# EAGLE design luxeon_r6_smd (EAGLE 5.08)
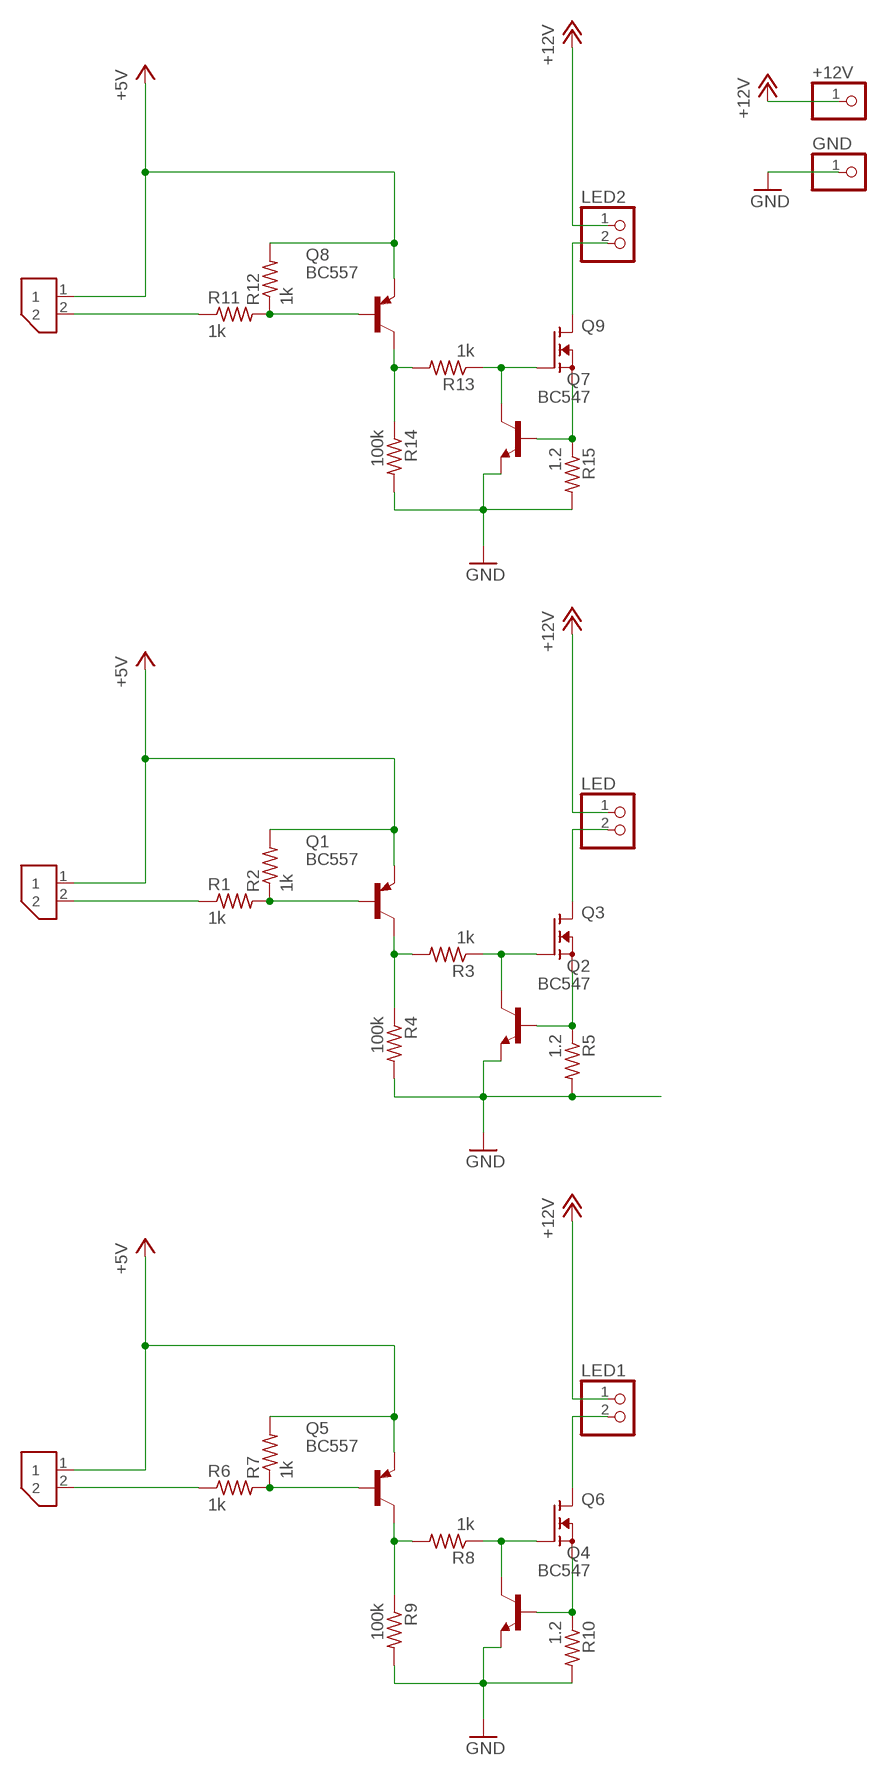
[diagram p0: schematic, sheet 1]

## Parts
+12V  PINHD-1X1  [1X01]
GND  PINHD-1X1  [1X01]
LED  PINHD-1X2  [1X02]
LED1  PINHD-1X2  [1X02]
LED2  PINHD-1X2  [1X02]
Q1  BC557  [TO92]
Q2  BC547  [TO92]
Q3  TOSHIBA-2SK4033  [TO252]
Q4  BC547  [TO92]
Q5  BC557  [TO92]
Q6  TOSHIBA-2SK4033  [TO252]
Q7  BC547  [TO92]
Q8  BC557  [TO92]
Q9  TOSHIBA-2SK4033  [TO252]
R1  1k  R-US_R0402  [R0402]
R2  1k  R-US_R0402  [R0402]
R3  1k  R-US_R0402  [R0402]
R4  100k  R-US_R0402  [R0402]
R5  1.2  R-US_R2512  [R2512]
R6  1k  R-US_R0402  [R0402]
R7  1k  R-US_R0402  [R0402]
R8  1k  R-US_R0402  [R0402]
R9  100k  R-US_R0402  [R0402]
R10  1.2  R-US_R2512  [R2512]
R11  1k  R-US_R0402  [R0402]
R12  1k  R-US_R0402  [R0402]
R13  1k  R-US_R0402  [R0402]
R14  100k  R-US_R0402  [R0402]
R15  1.2  R-US_R2512  [R2512]
TO_SLAVE  MOLEX-SPOX-HEADER-2-RA  [SPOX-WTB-HEADER-2-RA]
TO_SLAVE1  MOLEX-SPOX-HEADER-2-RA  [SPOX-WTB-HEADER-2-RA]
TO_SLAVE2  MOLEX-SPOX-HEADER-2-RA  [SPOX-WTB-HEADER-2-RA]

## Nets
+5V: Q1.1(E) Q5.1(E) Q8.1(E) R2.2 R7.2 R12.2 TO_SLAVE1.1 TO_SLAVE2.1 TO_SLAVE.1
+12V: +12V.1 LED1.1 LED2.1 LED.1
DISSIPATE: LED.2 Q3.3(D)
DISSIPATE1: LED1.2 Q6.3(D)
DISSIPATE2: LED2.2 Q9.3(D)
GND: GND.1 Q2.1(E) Q4.1(E) Q7.1(E) R4.2 R5.2 R9.2 R10.2 R14.2 R15.2
N$1: Q1.2(B) R1.2 R2.1
N$2: Q2.3(C) Q3.1(G) R3.1
N$3: Q1.3(C) R3.2 R4.1
N$4: Q2.2(B) Q3.2(S) R5.1
N$5: Q5.2(B) R6.2 R7.1
N$6: Q5.3(C) R8.2 R9.1
N$7: Q4.2(B) Q6.2(S) R10.1
N$8: Q4.3(C) Q6.1(G) R8.1
N$9: Q8.2(B) R11.2 R12.1
N$10: Q8.3(C) R13.2 R14.1
N$11: Q7.2(B) Q9.2(S) R15.1
N$12: Q7.3(C) Q9.1(G) R13.1
SLV: R1.1 TO_SLAVE.2
SLV1: R6.1 TO_SLAVE1.2
SLV2: R11.1 TO_SLAVE2.2

## Library data of the parts
+12V GND = pinhead:PINHD-1X1: PIN HEADER
LED LED1 LED2 = pinhead:PINHD-1X2: PIN HEADER
Q1 Q5 Q8 = transistor-pnp:BC557: PNP Transistor
Q2 Q4 Q7 = transistor:BC547: NPN TRANSISTOR
Q3 Q6 Q9 = damians_bits:TOSHIBA-2SK4033: TOSHIBA 2SK4033 Field Effect Transistor N-Channel MOSFET
R1-R15 = resistor:R-US_: RESISTOR, American symbol
TO_SLAVE TO_SLAVE1 TO_SLAVE2 = damians_bits:MOLEX-SPOX-HEADER-2-RA: Molex SPOX 22-05-7025 WTB Header, Right-angle, 2 way

## Board
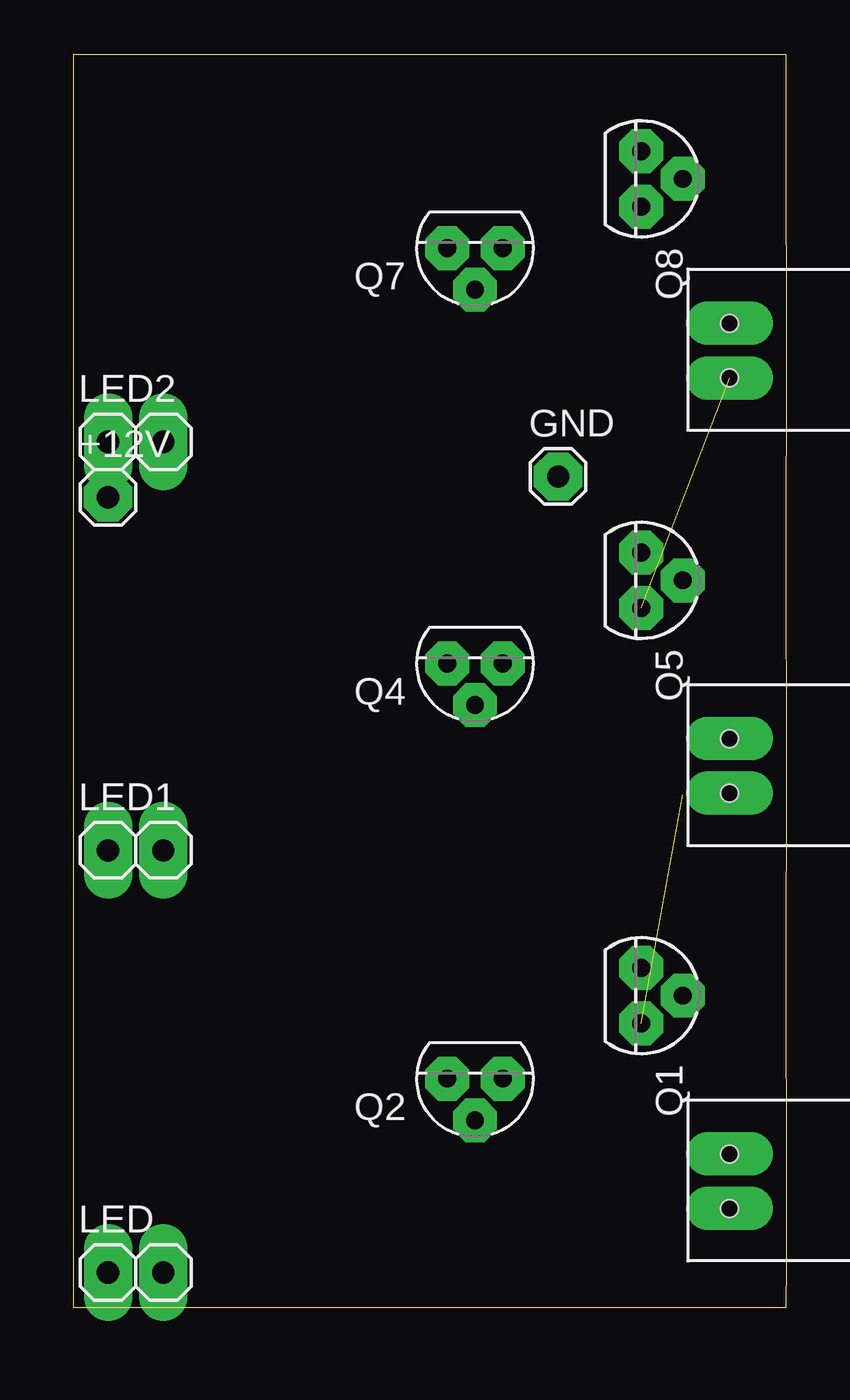
[diagram p1: board, top side]
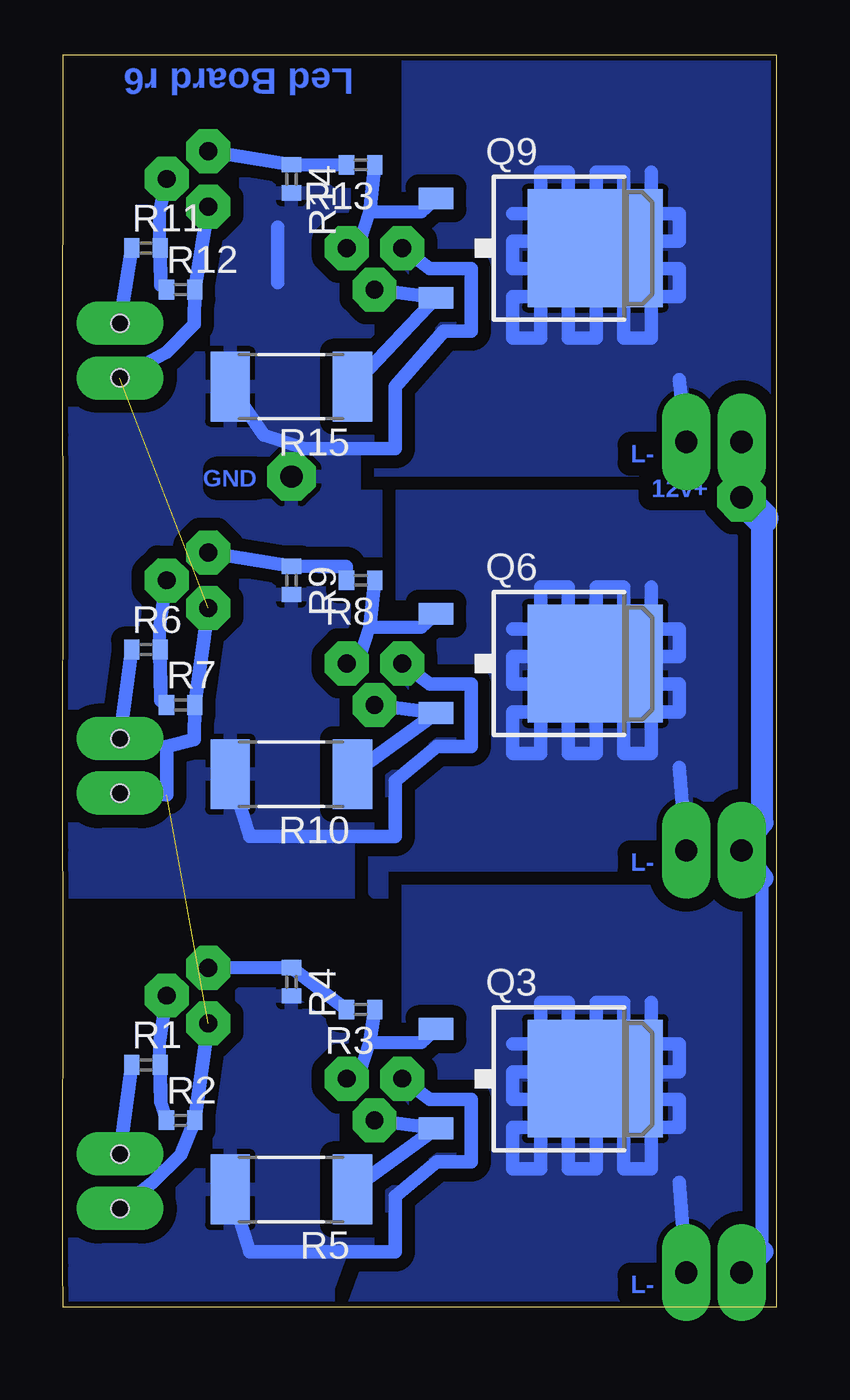
[diagram p2: board, bottom side, seen from below]

Size 32.7 x 57.46 mm. Coordinates in mm from the lower left corner, seen from the top.
Outline: 32.69,19.04 32.7,1.91 32.69,0 0,0 0,19.04
Outline: 32.69,19.05 32.7,20.95 32.69,38.41
Outline: 32.69,38.1 32.7,40.01 32.69,57.46 0,57.46 0,19.05
Copper layers (1*16): Top 0.035mm / dielectric 1.5mm / Bottom 0.035mm
Design rules "default *": minimum track width 0.6mm, minimum drill 0.8mm, track to track 0.6mm, track to pad 0.6mm, pad to pad 0.45mm, via to via 0.6mm, smd to smd 8mil, copper to edge 10mil, drill to drill 8mil, minimum pad ring 0.6mm, minimum via ring 0.6mm, stop-mask expansion 0mil, vias tented up to drill 0mil, thermal gap 10mil

### Footprints (pad centres in the part's own frame; a part is rotated, then mirrored left to right if it is on the bottom)
1X01 = drill 1.016 octagon: 1 0,0
1X02 = drill 1.016 long: 1 -1.27,0; 2 1.27,0
TO92 = drill 0.813 octagon: 1 1.27,0; 2 0,1.905; 3 -1.27,0
TO252 = smd 1 x 1.6: 1 -2.28,-4.8; 2 2.28,-4.8 | smd 5.4 x 6.2: 3 0,2.5
R0402 = smd 0.7 x 0.9: 1 -0.65,0; 2 0.65,0
R2512 = smd 1.8 x 3.2: 1 -2.8,0; 2 2.8,0
SPOX-WTB-HEADER-2-RA = drill 0.8 long: 1 1.19,0.56; 2 -1.31,0.56 | hole 0.8: -1.31,0.56; 1.19,0.56

### Placement (x,y rotation side)
+12V  1.59,37.15 0 top
GND  22.23,38.1 0 top
LED  2.86,1.59 0 top
LED1  2.86,20.95 0 top
LED2  2.86,39.69 0 top
Q1  26.04,14.29 270 top
Q2  18.41,10.48 180 top
Q3  10.79,10.48 270 bottom
Q4  18.41,29.53 180 top
Q5  26.04,33.34 270 top
Q6  10.79,29.53 270 bottom
Q7  18.41,48.58 180 top
Q8  26.04,51.75 270 top
Q9  10.79,48.58 270 bottom
R1  28.89,11.11 0 bottom
R2  27.3,8.57 0 bottom
R3  19.05,13.65 180 bottom
R4  22.23,14.92 270 bottom
R5  22.23,5.4 180 bottom
R6  28.89,30.16 0 bottom
R7  27.3,27.62 0 bottom
R8  19.05,33.34 180 bottom
R9  22.23,33.34 270 bottom
R10  22.23,24.45 180 bottom
R11  28.89,48.58 0 bottom
R12  27.3,46.67 0 bottom
R13  19.05,52.39 180 bottom
R14  22.23,51.75 270 bottom
R15  22.23,42.23 180 bottom
TO_SLAVE  29.53,5.71 270 top
TO_SLAVE1  29.53,24.77 270 top
TO_SLAVE2  29.53,43.81 270 top

### Tracks (layer width: path | path; a pad name or v marks a point on that pad's centre or on a via)
+5V  (2 unrouted)
  Bottom 0.61: TO_SLAVE.1 28.57,5.71 27.3,6.99 R2.2 Q1.1 | TO_SLAVE2.1 27.94,43.81 26.67,45.09 R12.2 Q8.1 | TO_SLAVE1.1 27.94,23.5 27.94,25.72 26.67,26.04 R7.2 Q5.1
+12V
  Bottom 0.6: 0.64,2.54 0.64,19.68
  Bottom 1: 0.64,36.2 0.64,22.23 LED1.1 0.64,19.68 | LED.1 0.64,2.54
  Bottom 1.5: LED2.1 +12V.1 0.64,36.2
DISSIPATE
  Bottom 0.61: 5.71,13.97 5.71,6.35 6.99,6.35 6.99,13.97 8.26,13.97 8.26,6.35 9.53,6.35 9.53,13.97 10.79,13.97 10.79,6.35 12.06,6.35 12.06,8.26 4.45,8.26 4.45,9.53 12.06,9.53 12.06,10.79 4.45,10.79 4.45,12.06 12.06,12.06 | LED.2 4.45,5.71
  pour Bottom (isolate 0.254): 17.14,19.37 0,19.37 0.64,0 19.68,0 18.41,3.49 15.24,6.67 13.97,7.3 17.14,9.21
DISSIPATE1
  Bottom 0.61: 5.71,33.02 5.71,25.4 6.99,25.4 6.99,33.02 8.26,33.02 8.26,25.4 9.53,25.4 9.53,33.02 10.79,33.02 10.79,25.4 12.06,25.4 12.06,27.3 4.45,27.3 4.45,28.57 12.06,28.57 12.06,29.84 4.45,29.84 4.45,31.11 12.06,31.11 | LED1.2 4.45,24.77
  pour Bottom (isolate 0.254, rank 3): 17.14,38.42 0,38.42 0,19.05 18.41,19.05 18.41,22.54 15.24,25.72 13.97,26.35 17.14,28.26
DISSIPATE2
  Bottom 0.61: 5.71,52.07 5.71,44.45 6.99,44.45 6.99,52.07 8.26,52.07 8.26,44.45 9.53,44.45 9.53,52.07 10.79,52.07 10.79,44.45 12.06,44.45 12.06,46.35 4.45,46.35 4.45,47.62 12.06,47.62 12.06,48.9 4.45,48.9 4.45,50.16 12.06,50.16 | LED2.2 4.45,42.55
  pour Bottom (isolate 0.254, rank 2): 17.14,57.47 0,57.47 0,38.1 18.41,38.1 18.41,41.59 15.24,44.77 13.97,45.4 17.14,47.31
GND
  Bottom 0.61: Q2.1 15.88,9.53 13.97,9.53 13.97,6.67 15.56,6.67 17.46,5.08 17.46,2.54 24.13,2.54 R5.2 | 22.86,46.99 22.86,49.53 | Q7.1 15.88,47.62 13.97,47.62 13.97,44.77 15.24,44.77 17.46,42.23 17.46,39.37 21.59,39.37 23.5,40.01 R15.2 | Q4.1 15.88,28.57 13.97,28.57 13.97,25.72 15.56,25.72 17.46,24.13 17.46,21.59 24.13,21.59 R10.2
  pour Bottom (rank 6): 32.7,0 32.7,19.37 17.14,19.37 17.14,9.21 13.97,7.3 15.88,6.35 18.73,3.49 18.73,0
  pour Bottom (rank 6): 32.7,38.1 32.7,57.47 17.14,57.47 17.14,47.31 13.97,45.4 15.88,44.45 18.73,41.59 18.73,38.1
  pour Bottom (rank 6): 32.7,19.05 32.7,38.42 17.14,38.42 17.14,28.26 13.97,26.35 15.88,25.4 18.73,22.54 18.73,19.05
N$1
  Bottom 0.6: R2.1 28.22,9.41 28.27,11.05 28.27,12.14 Q1.2
  Bottom 0.61: 28.22,9.41 R1.2
N$2
  Bottom 0.6: Q3.1 16.27,12.14 18.64,12.14 19.27,10.14 Q2.3
  Bottom 0.61: 18.64,12.14 R3.1
N$3
  Bottom 0.61: R3.2 R4.1 Q1.3
N$4
  Bottom 0.61: Q2.2 Q3.2 R5.1
N$5
  Bottom 0.6: R7.1 28.22,27.83 28.27,30.1 28.27,31.19 Q5.2
  Bottom 0.61: 28.22,27.83 R6.2
N$6
  Bottom 0.61: R8.2 19.7,33.97 20.95,33.97 R9.1 Q5.3
N$7
  Bottom 0.61: Q4.2 Q6.2 R10.1
N$8
  Bottom 0.6: Q6.1 16.27,31.19 18.64,31.19 19.27,29.19 Q4.3
  Bottom 0.61: 18.64,31.19 R8.1
N$9
  Bottom 0.6: R12.1 28.22,46.88 28.27,49.15 28.27,50.24 Q8.2
  Bottom 0.61: 28.22,46.88 R11.2
N$10
  Bottom 0.61: R13.2 R14.1 Q8.3
N$11
  Bottom 0.61: Q7.2 Q9.2 R15.1
N$12
  Bottom 0.6: Q9.1 16.27,50.24 18.64,50.24 19.27,48.24 Q7.3
  Bottom 0.61: 18.64,50.24 R13.1
SLV
  Bottom 0.61: TO_SLAVE.2 R1.1
SLV1
  Bottom 0.61: TO_SLAVE1.2 R6.1
SLV2
  Bottom 0.61: TO_SLAVE2.2 R11.1

### Text on the board
Bottom: Led Board r6 | L- | GND | 12v+ | L- | L-